# Altium schematic sheet 2_topology.schdoc: EPS Topology
size A3; DrawnBy: Sara V. Martinez; DocumentNumber: 3; Revision: v0.3; SheetNumber: 3; SheetTotal: 11; Designed by: Andre M. P. Mattos; ProjectRevision: v0.3; ImagePath: Flight
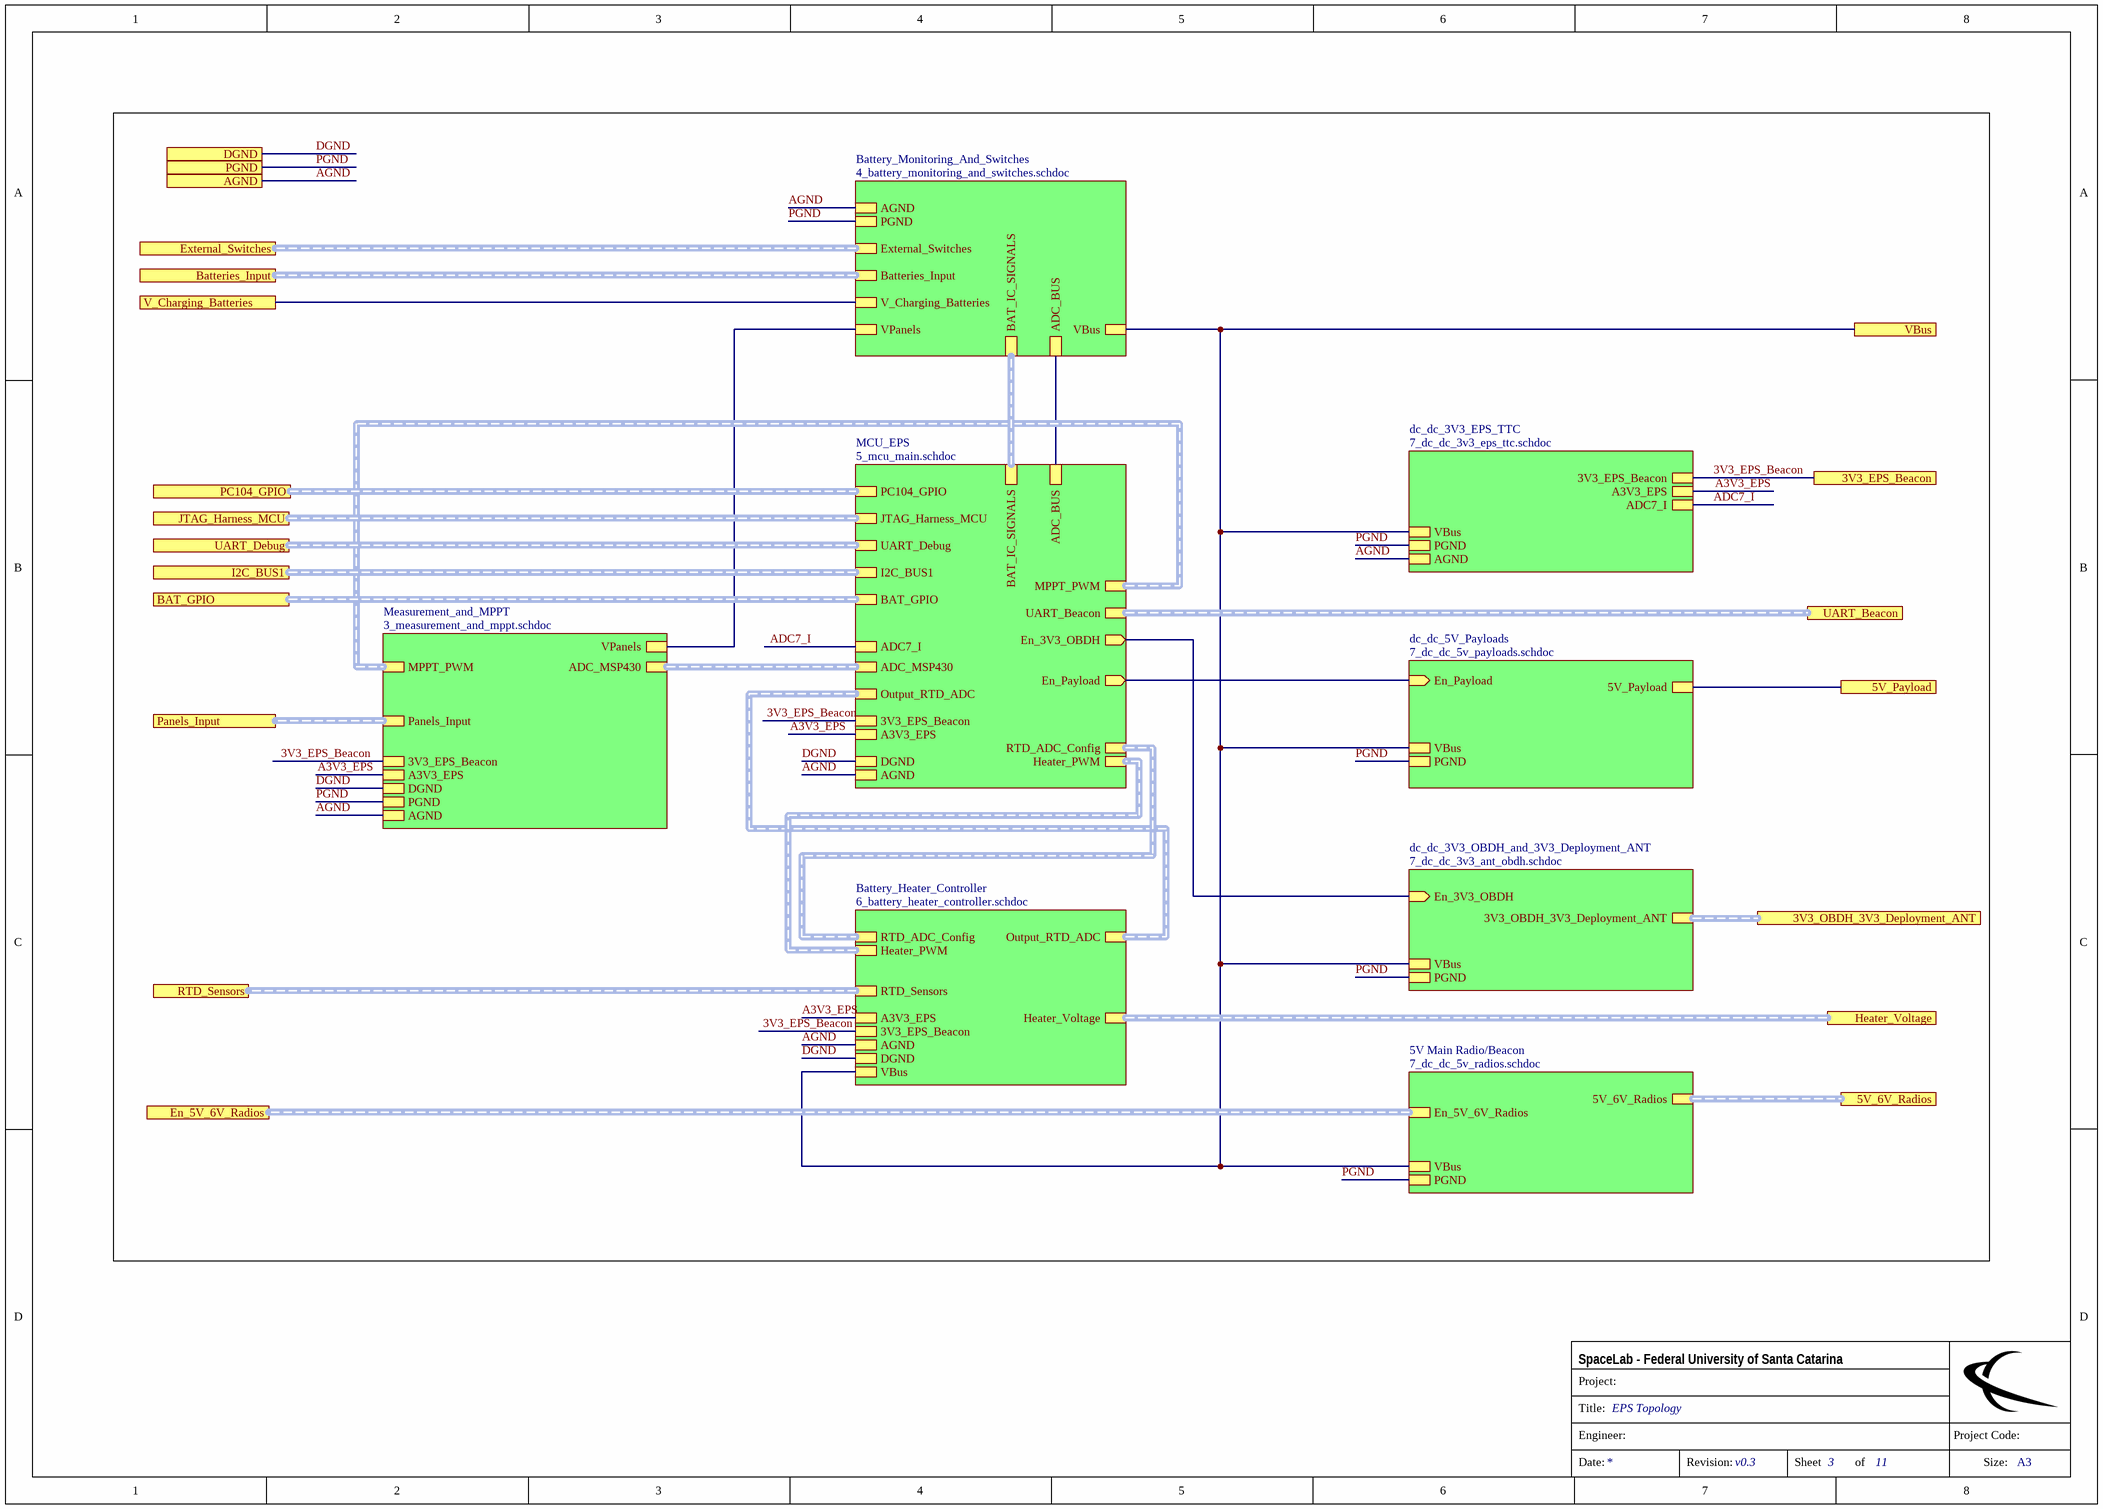
[diagram p0: 2_topology.schdoc]

## Sub-sheets
5V Main Radio/Beacon = 7_dc_dc_5v_radios.schdoc: PGND, VBus, 5V_6V_Radios (harness 5V_6V_Radios), En_5V_6V_Radios (harness En_5V_6V_Radios)
Battery_Heater_Controller = 6_battery_heater_controller.schdoc: Output_RTD_ADC (harness Output_RTD_ADC), RTD_ADC_Config (harness RTD_ADC_Config), Heater_PWM (harness Heater_PWM), Heater_Voltage (harness Heater_Voltage), RTD_Sensors (harness RTD_Sensors), 3V3_EPS_Beacon, VBus, DGND, AGND, A3V3_EPS
Battery_Monitoring_And_Switches = 4_battery_monitoring_and_switches.schdoc: VPanels, External_Switches (harness External_Switches), Batteries_Input (harness Batteries_Input), VBus, AGND, PGND, V_Charging_Batteries, ADC_BUS, BAT_IC_SIGNALS (harness BAT_IC_SIGNALS)
dc_dc_3V3_EPS_TTC = 7_dc_dc_3v3_eps_ttc.schdoc: 3V3_EPS_Beacon, PGND, AGND, A3V3_EPS, ADC7_I, VBus
dc_dc_3V3_OBDH_and_3V3_Deployment_ANT = 7_dc_dc_3v3_ant_obdh.schdoc: VBus, 3V3_OBDH_3V3_Deployment_ANT (harness 3V3_OBDH_3V3_Deployment_ANT), PGND, En_3V3_OBDH (in)
dc_dc_5V_Payloads = 7_dc_dc_5v_payloads.schdoc: 5V_Payload, PGND, En_Payload (in), VBus
MCU_EPS = 5_mcu_main.schdoc: ADC_MSP430 (harness ADC_MSP430), MPPT_PWM (harness MPPT_PWM), En_Payload (out), 3V3_EPS_Beacon, Output_RTD_ADC (harness Output_RTD_ADC), RTD_ADC_Config (harness RTD_ADC_Config), JTAG_Harness_MCU (harness JTAG_Harness_MCU), UART_Debug (harness UART_Debug), DGND, AGND, A3V3_EPS, ADC_BUS, ADC7_I, En_3V3_OBDH (out), UART_Beacon (harness UART_Beacon), Heater_PWM (harness Harness), PC104_GPIO (harness PC104_GPIO), BAT_GPIO, BAT_IC_SIGNALS (harness BAT_IC_SIGNALS), I2C_BUS1 (harness BUS1_I2C)
Measurement_and_MPPT = 3_measurement_and_mppt.schdoc: Panels_Input (harness Panels_Input), ADC_MSP430 (harness ADC_MSP430), VPanels, MPPT_PWM (harness MPPT_PWM), DGND, PGND, 3V3_EPS_Beacon, AGND, A3V3_EPS

## Ports
3V3_EPS_Beacon, 3V3_OBDH_3V3_Deployment_ANT (harness 3V3_OBDH_3V3_Deployment_ANT), 5V_6V_Radios (harness 5V_6V_Radios), 5V_Payload, AGND, BAT_GPIO (harness BAT_GPIO), Batteries_Input (harness Batteries_Input), DGND, En_5V_6V_Radios (harness En_5V_6V_Radios), External_Switches (harness External_Switches), Heater_Voltage (harness Heater_Voltage), I2C_BUS1 (harness BUS1_I2C), JTAG_Harness_MCU (harness JTAG_Harness_MCU), Panels_Input (harness Panels_Input), PC104_GPIO (harness PC104_GPIO), PGND, RTD_Sensors (harness RTD_Sensors), UART_Beacon (harness UART_Beacon), UART_Debug (harness UART_Debug), V_Charging_Batteries, VBus

## Nets
3V3_EPS_Beacon: port 3V3_EPS_Beacon, sheet Measurement_and_MPPT/3V3_EPS_Beacon, sheet MCU_EPS/3V3_EPS_Beacon, sheet dc_dc_3V3_EPS_TTC/3V3_EPS_Beacon, sheet Battery_Heater_Controller/3V3_EPS_Beacon
5V_Payload: port 5V_Payload, sheet dc_dc_5V_Payloads/5V_Payload
A3V3_EPS: sheet Measurement_and_MPPT/A3V3_EPS, sheet MCU_EPS/A3V3_EPS, sheet dc_dc_3V3_EPS_TTC/A3V3_EPS, sheet Battery_Heater_Controller/A3V3_EPS
ADC7_I: sheet MCU_EPS/ADC7_I, sheet dc_dc_3V3_EPS_TTC/ADC7_I
AGND: port AGND, sheet Measurement_and_MPPT/AGND, sheet MCU_EPS/AGND, sheet dc_dc_3V3_EPS_TTC/AGND, sheet Battery_Monitoring_And_Switches/AGND, sheet Battery_Heater_Controller/AGND
DGND: port DGND, sheet Measurement_and_MPPT/DGND, sheet MCU_EPS/DGND, sheet Battery_Heater_Controller/DGND
PGND: port PGND, sheet Measurement_and_MPPT/PGND, sheet dc_dc_5V_Payloads/PGND, sheet dc_dc_3V3_EPS_TTC/PGND, sheet dc_dc_3V3_OBDH_and_3V3_Deployment_ANT/PGND, sheet 5V Main Radio/Beacon/PGND, sheet Battery_Monitoring_And_Switches/PGND
V_Charging_Batteries: port V_Charging_Batteries, sheet Battery_Monitoring_And_Switches/V_Charging_Batteries
VBus: port VBus, sheet dc_dc_5V_Payloads/VBus, sheet dc_dc_3V3_EPS_TTC/VBus, sheet dc_dc_3V3_OBDH_and_3V3_Deployment_ANT/VBus, sheet 5V Main Radio/Beacon/VBus, sheet Battery_Monitoring_And_Switches/VBus, sheet Battery_Heater_Controller/VBus
(unnamed): sheet Measurement_and_MPPT/VPanels, sheet Battery_Monitoring_And_Switches/VPanels
(unnamed): sheet MCU_EPS/En_Payload, sheet dc_dc_5V_Payloads/En_Payload
(unnamed): sheet MCU_EPS/ADC_BUS, sheet Battery_Monitoring_And_Switches/ADC_BUS
(unnamed): sheet MCU_EPS/En_3V3_OBDH, sheet dc_dc_3V3_OBDH_and_3V3_Deployment_ANT/En_3V3_OBDH

## Buses and harness runs
harness port 3V3_OBDH_3V3_Deployment_ANT = sheet dc_dc_3V3_OBDH_and_3V3_Deployment_ANT/3V3_OBDH_3V3_Deployment_ANT
harness port 5V_6V_Radios = sheet 5V Main Radio/Beacon/5V_6V_Radios
harness port BAT_GPIO = sheet MCU_EPS/BAT_GPIO
harness port Batteries_Input = sheet Battery_Monitoring_And_Switches/Batteries_Input
harness port En_5V_6V_Radios = sheet 5V Main Radio/Beacon/En_5V_6V_Radios
harness port External_Switches = sheet Battery_Monitoring_And_Switches/External_Switches
harness port Heater_Voltage = sheet Battery_Heater_Controller/Heater_Voltage
harness port I2C_BUS1 = sheet MCU_EPS/I2C_BUS1
harness port JTAG_Harness_MCU = sheet MCU_EPS/JTAG_Harness_MCU
harness port Panels_Input = sheet Measurement_and_MPPT/Panels_Input
harness port PC104_GPIO = sheet MCU_EPS/PC104_GPIO
harness port RTD_Sensors = sheet Battery_Heater_Controller/RTD_Sensors
harness port UART_Beacon = sheet MCU_EPS/UART_Beacon
harness port UART_Debug = sheet MCU_EPS/UART_Debug
harness sheet Battery_Heater_Controller/Heater_PWM = sheet MCU_EPS/Heater_PWM
harness sheet Battery_Heater_Controller/Output_RTD_ADC = sheet MCU_EPS/Output_RTD_ADC
harness sheet Battery_Heater_Controller/RTD_ADC_Config = sheet MCU_EPS/RTD_ADC_Config
harness sheet Battery_Monitoring_And_Switches/BAT_IC_SIGNALS = sheet MCU_EPS/BAT_IC_SIGNALS
harness sheet MCU_EPS/ADC_MSP430 = sheet Measurement_and_MPPT/ADC_MSP430
harness sheet MCU_EPS/MPPT_PWM = sheet Measurement_and_MPPT/MPPT_PWM

## Notes on the sheet
- Project:
- SpaceLab - Federal University of Santa Catarina
- Title:
- Engineer:
- Project Code:
- Date:
- Revision:
- Sheet
- of
- Size:
- A3